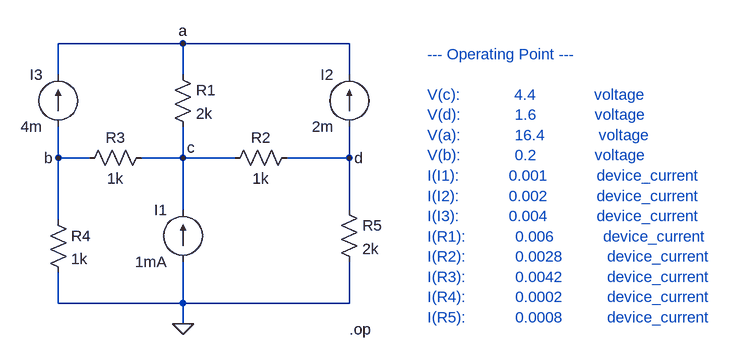
[diagram p0: schematic Q2LT.asc]
Q2LT.asc, the LTspice schematic file:
Version 4
SHEET 1 1108 680
WIRE 240 -48 48 -48
WIRE 496 -48 240 -48
WIRE 48 0 48 -48
WIRE 240 0 240 -48
WIRE 496 0 496 -48
WIRE 48 128 48 80
WIRE 96 128 48 128
WIRE 240 128 240 80
WIRE 240 128 176 128
WIRE 320 128 240 128
WIRE 496 128 496 80
WIRE 496 128 400 128
WIRE 240 208 240 128
WIRE 496 208 496 128
WIRE 48 224 48 128
WIRE 48 352 48 304
WIRE 240 352 240 288
WIRE 240 352 48 352
WIRE 496 352 496 288
WIRE 496 352 240 352
WIRE 240 384 240 352
FLAG 240 384 0
FLAG 240 -48 a
FLAG 48 128 b
FLAG 240 128 c
FLAG 496 128 d
SYMBOL current 240 288 R180
WINDOW 0 24 80 Left 2
WINDOW 3 24 0 Left 2
SYMATTR InstName I1
SYMATTR Value 1mA
SYMBOL current 496 80 R180
WINDOW 0 24 80 Left 2
WINDOW 3 24 0 Left 2
SYMATTR InstName I2
SYMATTR Value 2m
SYMBOL current 48 80 R180
WINDOW 0 24 80 Left 2
WINDOW 3 24 0 Left 2
SYMATTR InstName I3
SYMATTR Value 4m
SYMBOL res 224 -16 R0
SYMATTR InstName R1
SYMATTR Value 2k
SYMBOL res 304 144 R270
WINDOW 0 32 56 VTop 2
WINDOW 3 0 56 VBottom 2
SYMATTR InstName R2
SYMATTR Value 1k
SYMBOL res 192 112 R90
WINDOW 0 0 56 VBottom 2
WINDOW 3 32 56 VTop 2
SYMATTR InstName R3
SYMATTR Value 1k
SYMBOL res 32 208 R0
SYMATTR InstName R4
SYMATTR Value 1k
SYMBOL res 480 192 R0
SYMATTR InstName R5
SYMATTR Value 2k
TEXT 496 392 Left 2 !.op
TEXT 616 -32 Left 2 ;--- Operating Point ---\n \nV(c):            4.4             voltage\nV(d):            1.6             voltage\nV(a):            16.4            voltage\nV(b):            0.2             voltage\nI(I1):           0.001           device_current\nI(I2):           0.002           device_current\nI(I3):           0.004           device_current\nI(R1):           0.006           device_current\nI(R2):           0.0028          device_current\nI(R3):           0.0042          device_current\nI(R4):           0.0002          device_current\nI(R5):           0.0008          device_current

The netlist it stands for:
* Q2LT.asc
I1 0 c 1mA
I2 d a 2m
I3 b a 4m
R1 a c 2k
R2 c d 1k
R3 c b 1k
R4 b 0 1k
R5 d 0 2k
.op
* --- Operating Point ---
* V(c):            4.4             voltage
* V(d):            1.6             voltage
* V(a):            16.4            voltage
* V(b):            0.2             voltage
* I(I1):           0.001           device_current
* I(I2):           0.002           device_current
* I(I3):           0.004           device_current
* I(R1):           0.006           device_current
* I(R2):           0.0028          device_current
* I(R3):           0.0042          device_current
* I(R4):           0.0002          device_current
* I(R5):           0.0008          device_current
.backanno
.end

* Results of the author's LTspice run, read from the files saved beside the schematic
* Operating Point:
*   V(c) = 4.4 V
*   V(d) = 1.6 V
*   V(a) = 16.4 V
*   V(b) = 200 mV
*   I(I1) = 1 mA
*   I(I2) = 2 mA
*   I(I3) = 4 mA
*   I(R1) = 6 mA
*   I(R2) = 2.8 mA
*   I(R3) = 4.2 mA
*   I(R4) = 200 µA
*   I(R5) = 800 µA